# Altium schematic sheet UBC-Thunderbots_PCB_Power__archive_chicker-v1.0_pcb__Top.SchDoc
size A4
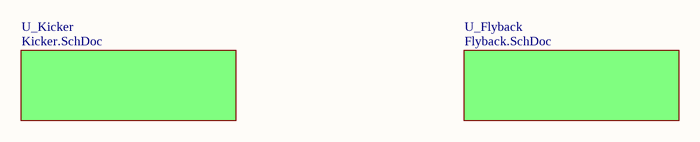
[diagram p0: UBC-Thunderbots_PCB_Power__archive_chicker-v1.0_pcb__Top.SchDoc]

## Sub-sheets
U_Flyback = Flyback.SchDoc: no entries
U_Kicker = Kicker.SchDoc: no entries